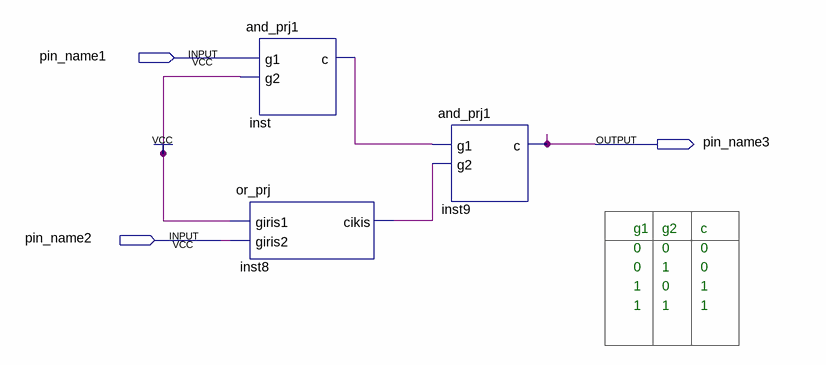
[diagram p0: schematic sheet]
// Quartus schematic orandprj.bdf as structural Verilog: 3 symbols, 3 pins
module orandprj (
  input  pin_name1,
  input  pin_name2,
  output pin_name3
);

  wire inst8_cikis, inst_c;

  and_prj1 inst (.g1(pin_name1), .g2(1'b1), .c(inst_c));
  or_prj inst8 (.giris1(1'b1), .giris2(pin_name2), .cikis(inst8_cikis));
  and_prj1 inst9 (.g1(inst_c), .g2(inst8_cikis), .c(pin_name3));

  // Notes on the sheet:
  //   g1
  //   g2
  //   c
  //   0
  //   0
  //   0
  //   0
  //   1
  //   0
  //   1
  //   0
  //   1
  //   1
  //   1
  //   1
endmodule
